# Altium schematic sheet PC_Starter.SchDoc
size A4
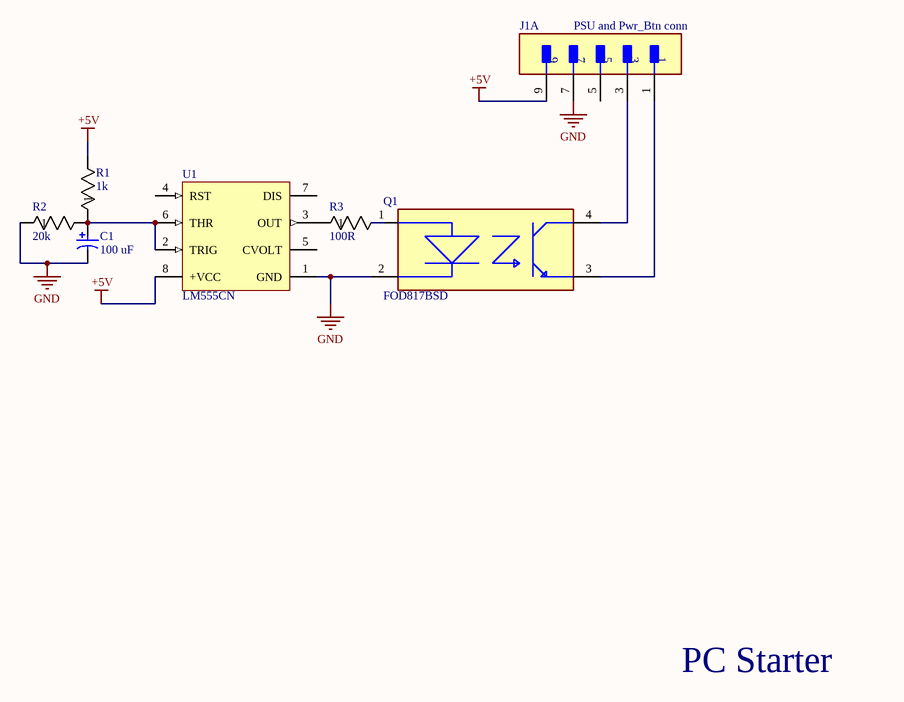
[diagram p0: PC_Starter.SchDoc]

## Parts
C1  100 uF  [NIC-RNS-8x11.5-2_V]
J1  PSU and Pwr_Btn conn  [FP-M50-3600542-MFG]  (part A of 2)
Q1  FOD817BSD  [FP-709AH-MFG]
R1  1k  [RES_AC05_VIS]
R2  20k  [RES_AC05_VIS]
R3  100R  [RES_AC01_VIS]
U1  LM555CN  [N08E]

## Nets
 +5V: J1.9 R1.2 U1.8(+VCC)
GND: C1.2 J1.7 Q1.2(C) R2.1 U1.1(GND)
NetC1_1: C1.1 R1.1 R2.2 U1.2(TRIG) U1.6(THR)
NetJ1_1: J1.1 Q1.3(E)
NetJ1_3: J1.3 Q1.4(C)
NetQ1_1: Q1.1(A) R3.2
NetR3_1: R3.1 U1.3(OUT)

Not connected (* = marked no-connect by the designer): J1 5; U1 4(RST) 5(CVOLT) 7(DIS)

## Notes on the sheet
- PC Starter

## Library data of the parts
C1 = CMP-1235-00001-1: Aluminum Electrolytic Capacitor, 100 uF +/-20%, 10 V, -55 to 105 degC, 2-Pin THD, RoHS; PartNumber: RNS1A101MDN1KX; Manufacturer: Nichicon; Rated Ripple: 3900 mA; Rated Voltage: 10 V; Leakage Current: 0.15 mA; Capacitance Tolerance: +/-20%; ComponentLink1URL: http://www.nichicon.co.jp/; ComponentLink3URL: http://www.nichicon.co.jp/english/products/pdf/2013fpcap_catalog_ns.pdf; ComponentLink1Description: Manufacturer URL; ComponentLink2URL: http://www.nichicon.co.jp/english/products/pdfs/e-ns.pdf; PackageDescription: 2-Pin Through Hole Device, Dia 8 mm, Body Length 11.5 mm, Pin Spacing 3.5 mm; Temperature Range: -55 to 105 degC; ComponentLink3Description: Package Specification; Mounting Technology: Through Hole; DatasheetVersion: Sep-13; RoHS: TRUE; ComponentLink2Description: Datasheet; Rated Capacitance: 100 uF
J1 = CMP-15831-000019-1: CONN HEADER SMD 10POS 1.27MM; Gender: Male; Insulation Resistance: 5GR; Row Spacing: 0.05inch; Number of Contacts: 10; Current Rating: 1A; Contact Resistance: 30mR; Length: 6.35mm; Mount: Surface Mount; Radiation Hardening: No; Contact Material: Copper Alloy; Material: Thermoplastic; Package Quantity: 1000; Contact Plating: Gold; Depth: 3.41mm; Contact Mating Length: 0.118inch; Number of Rows: 2; Pitch: 1.27mm; Packaging: Tray; Termination: Solder; Number of Positions: 10; Max Current Rating: 1A; Insulation Material: Thermoplastic; REACH SVHC: No SVHC; Min Operating Temperature: -40°C; Color: Black; Housing Material: Thermoplastic; Max Operating Temperature: 105°C; Orientation: Straight
Q1 = CMP-2000-06280-2: OPTOISOLATOR 5KV TRANSISTOR 4SMD; Manufacturer: ON Semiconductor; Reverse Voltage: 6V; Forward Current: 20mA; Standoff Height: 0.35mm; Power Dissipation: 200mW; Max Junction Temp: +125°C; Isolation Voltage: 5000Vrms; Max Current Transfer Ratio: 260%; Min Current Transfer Ratio: 130%; Collector Emitter Voltage: 70V; Forward Voltage: 1.2V; Height: 4.35mm; Temperature Range High: +110°C; Automotive: No; Footprint Url: https://www.onsemi.com/pub/Collateral/709AH.PDF; Manufacturer Part Number: FOD817BSD; Temperature Range Low: -55°C; Temperature: -55°C to +110°C; Package: 709AH; Lead Free: Yes; Mouser Description: Optocoupler DC-IN 1-CH Transistor DC-OUT 4-Pin PDIP SMD Black T/R; Category: Trans; Emiiter Collector Voltage: 6V; Digikey Description: OPTOISOLATOR 5KV TRANSISTOR 4SMD; ComponentLink2Description: Datasheet; Device Class L1: Optoelectronics; ComponentLink2URL: https://www.onsemi.com/pub/Collateral/FOD814-D.PDF; Device Class L2: Optocouplers; Octopart: https://octopart.com/fod817bsd-on+semiconductor-84327540; RoHS: TRUE; Device Class L3: unset
R1 R2 = CMP-00030-39746222-1: AC05000001001JAC00 Resistor, Wirewound, Res 1 Kilohms, Pwr-Rtg 5 W, Tol 5%, Axial, Ceramic Core; Temperature Coefficient: 180ppm/°C; Max Power Dissipation: 5W; Resistance: 1kΩ; Voltage Rating: 71V; Lead Diameter: 800µm; Termination: Axial; Width: 7.49mm; Tolerance: 5%; Features: Flame Retardant Coating; Lead Free: Lead Free; Radiation Hardening: No; Power Rating: 5W; Diameter: 7.5mm; Length: 18mm; Min Operating Temperature: 0°C; Max Operating Temperature: 275°C; Number of Pins: 2; Packaging: Tape & Box (TB); Contact Plating: Tin; Voltage Rating (DC): 71V; NexarPartId: 39746222; Military Standard: Not; Composition: Wirewound; Case/Package: Conformal; RoHS: Compliant; Schedule B: 8533210080, 8533210080; Mount: Through Hole; Number of Terminations: 2; REACH SVHC: Unknown
R3 = CMP-T1-00030-41941199_01-5: VISHAY AC01000001000JA100 Through Hole Resistor, 100 ohm, Axial Leaded, 1 W, 5%, AC Series; Voltage Rating (DC): 10V; Power Rating: 1W; Resistance: 100Ω; Temperature Coefficient: 180ppm/°C; Lead Diameter: 800µm; Min Operating Temperature: -40°C; RoHS: Compliant; Number of Pins: 2; Contact Plating: Tin; Voltage Rating: 10V; Number of Terminations: 2; Packaging: Cut Tape (CT); REACH SVHC: Unknown; Schedule B: 8533210080, 8533210080; Diameter: 4.3mm; Tolerance: 5%; Features: Flame Retardant Coating; Max Operating Temperature: 275°C; Composition: Metal Film, Wirewound; Mount: Through Hole; Max Power Dissipation: 1W; Length: 11mm; Termination: Axial; Lead Free: Lead Free; Case/Package: Conformal; Military Standard: Not; NexarPartId: 41941199
U1 = CMP-0056-00017-2: Timer, 8-pin MDIP; Manufacturer: National Semiconductor; CompType: Analog IC; PackageTopMarking: NSUZXYTTE#*LM*555CN; PowerWise: N; PackageReference: N08E; ComponentLink1Description: LM555 Datasheet; ComponentLink3URL: http://www.national.com/packaging/folders/n08e.html; ComponentLink1URL: http://www.national.com/ds/LM/LM555.pdf; ComponentLink2URL: http://www.national.com/pf/LM/LM555.html; PackageDescription: MDIP, .365 x .250 x .130in, 8 Lead, .100in Pitch; DatasheetVersion: Jul-2006; RevisionNote: Component URLs added; Code_JEDEC: MS-001-BA; PinCount: 8; ComponentLink3Description: N08E Package Page; PackageVersion: revG, May-2006; ComponentLink2Description: LM555 Web Page; RoHS: N